# EAGLE schematic openmv2 (EAGLE 6.4)
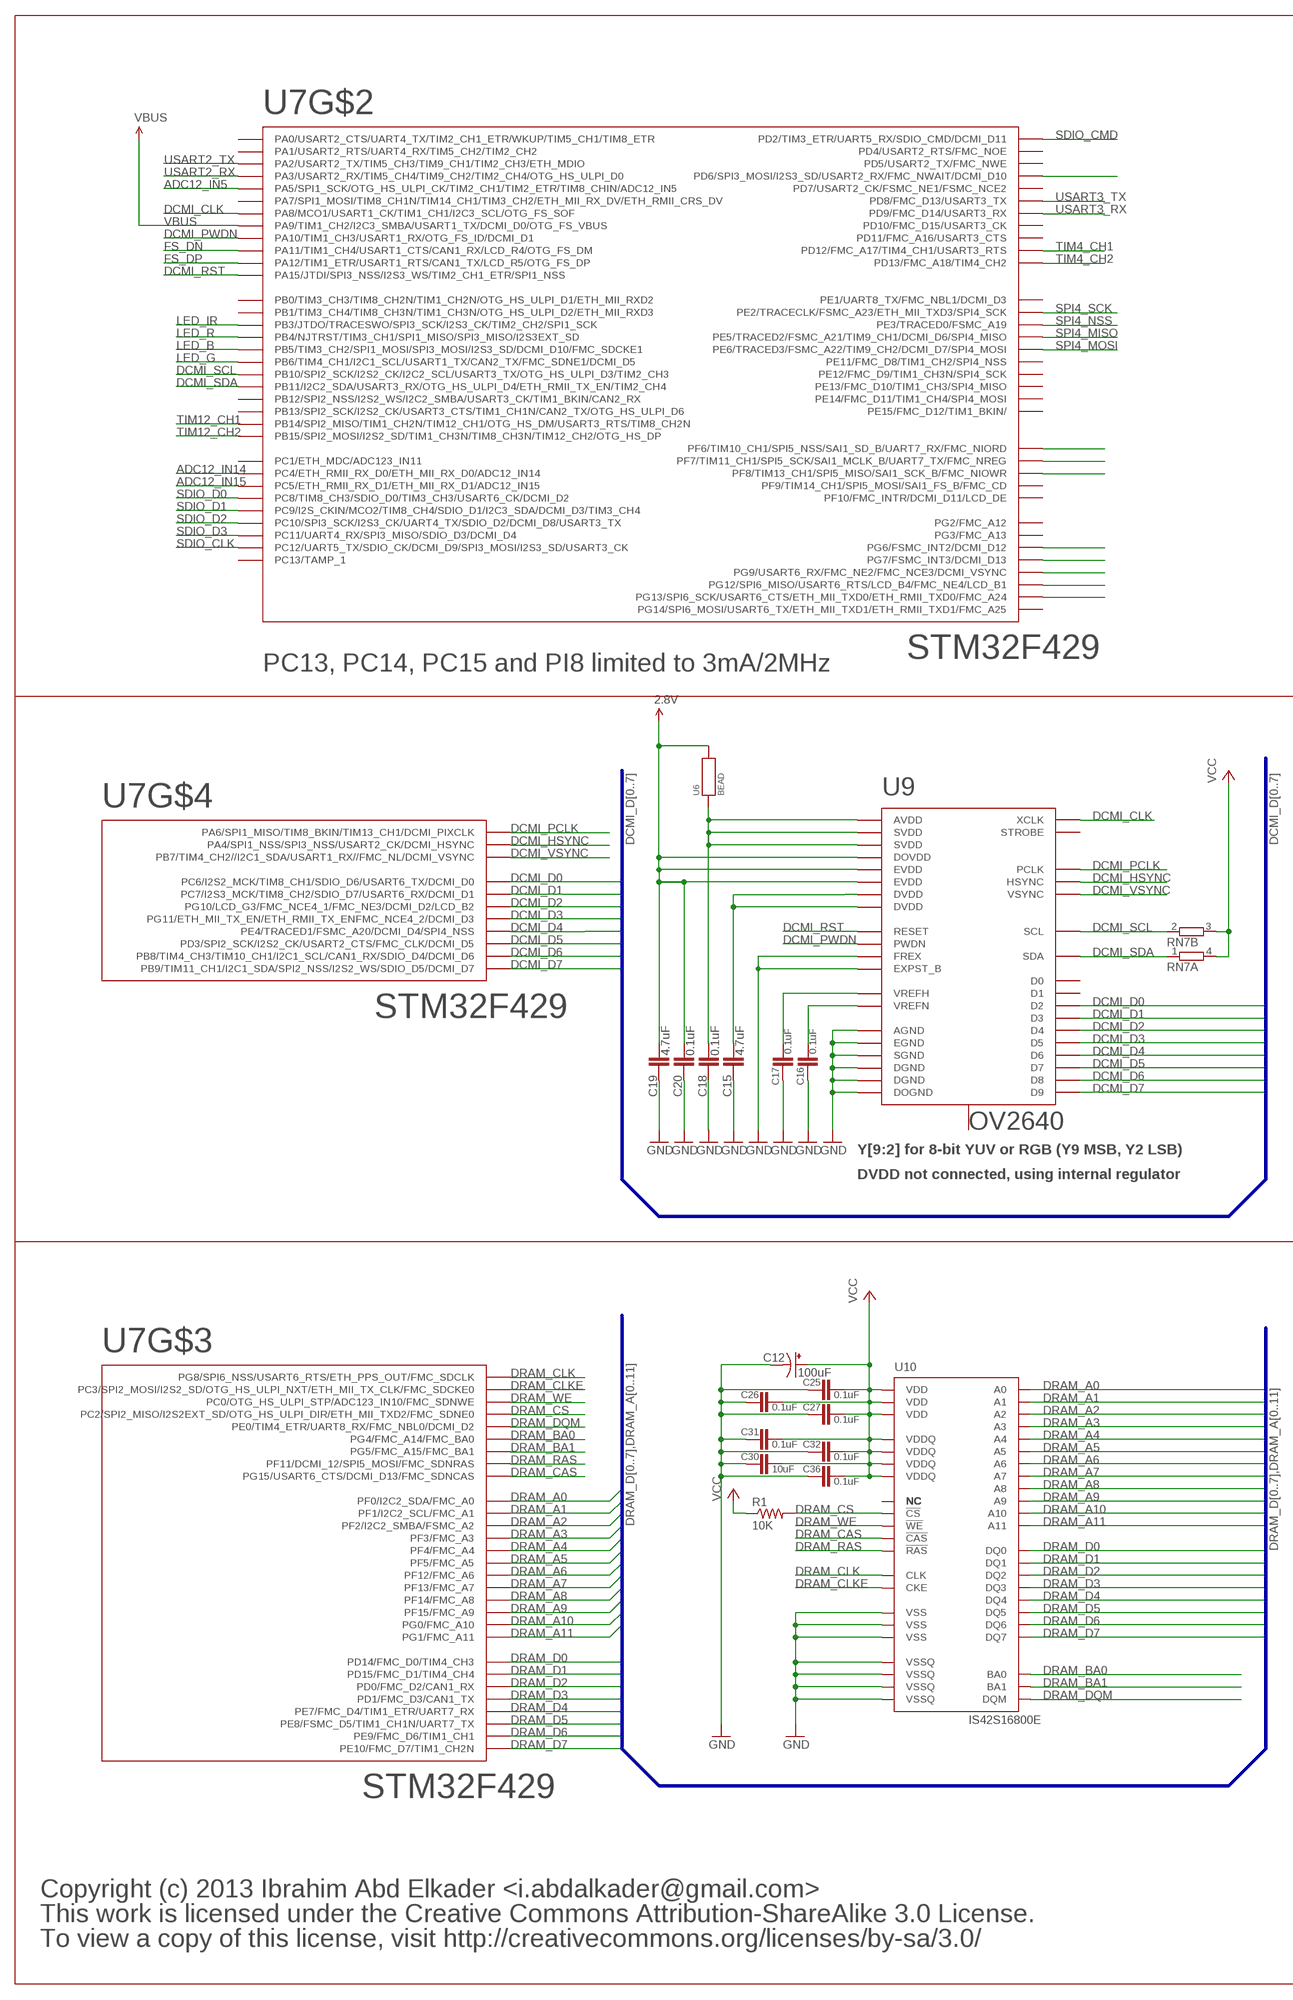
[diagram p0: schematic, sheet 1, part 1 of 2]
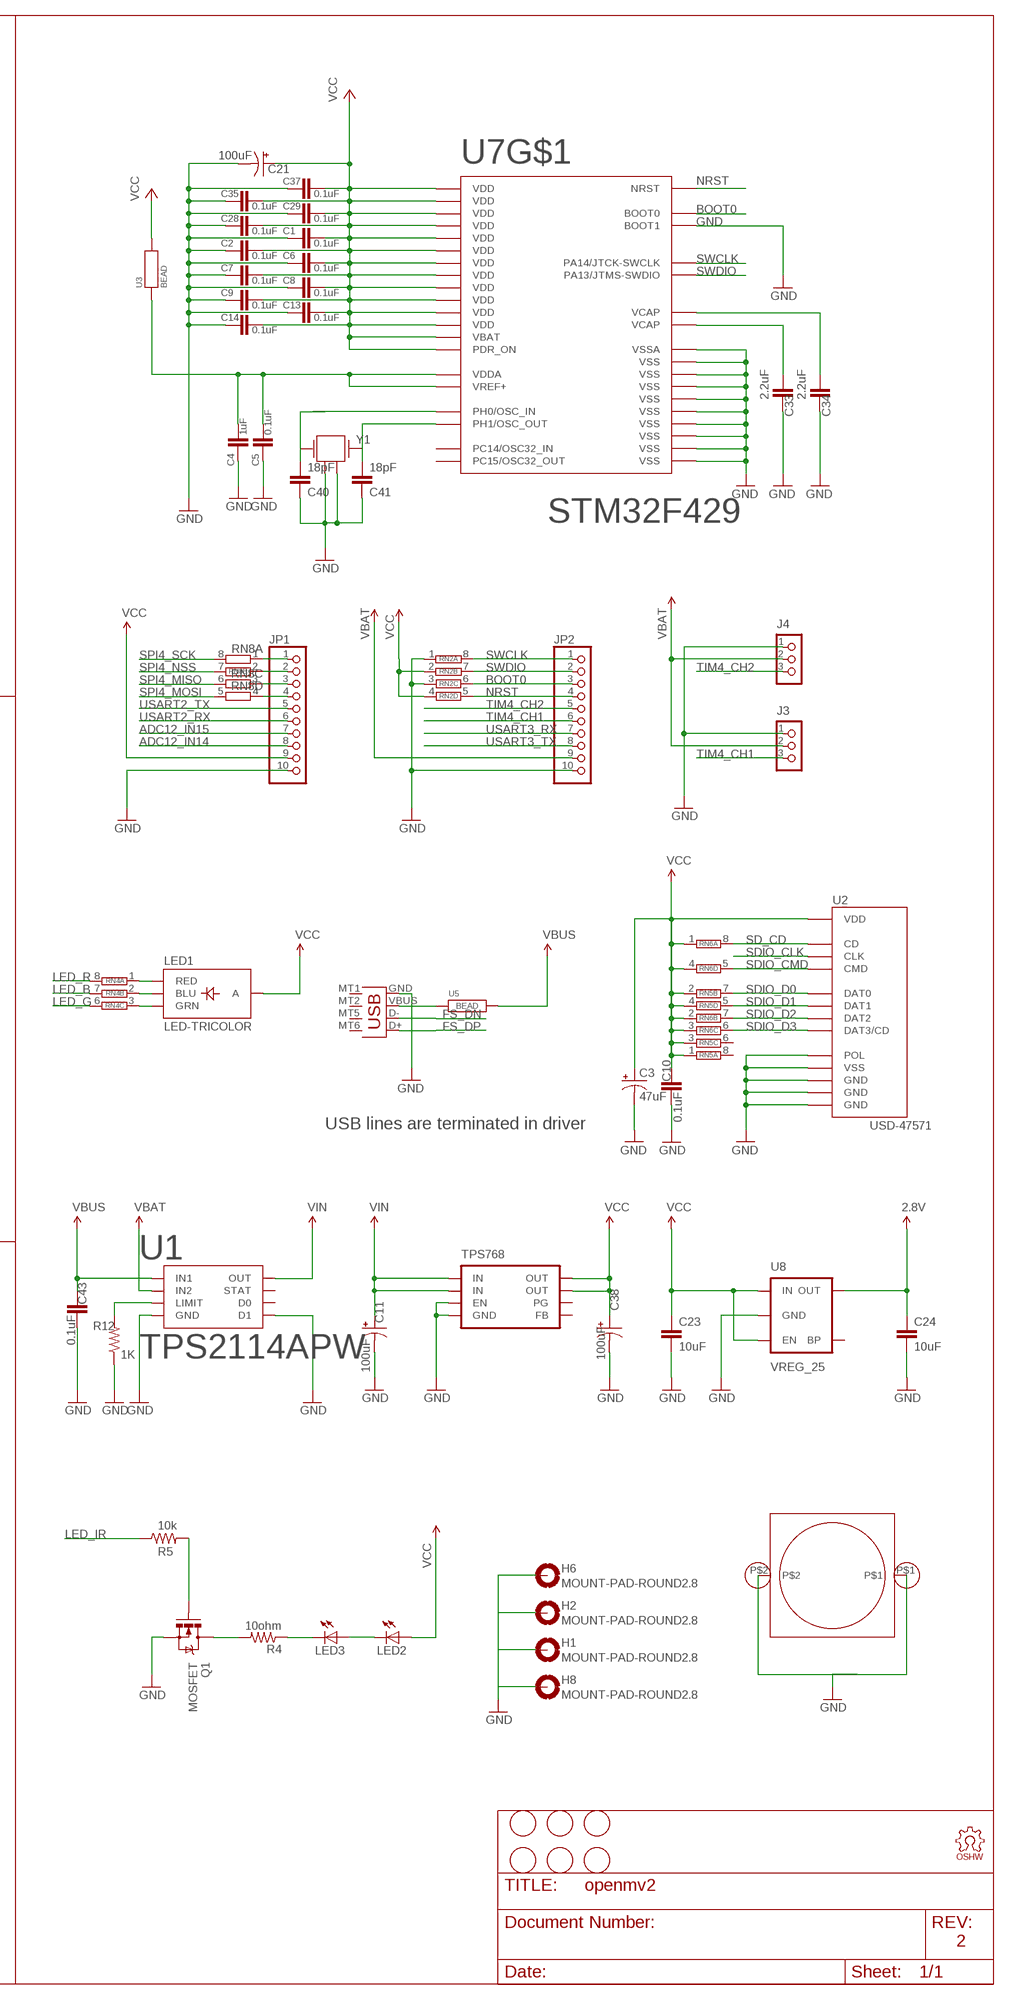
[diagram p1: schematic, sheet 1, part 2 of 2]

## Parts
C1  0.1uF  CAP0402-CAP  [0402-CAP]
C2  0.1uF  CAP0402-CAP  [0402-CAP]
C3  47uF  CAP_POL1206  [EIA3216]
C4  1uF  CAP0402-CAP  [0402-CAP]
C5  0.1uF  CAP0402-CAP  [0402-CAP]
C6  0.1uF  CAP0402-CAP  [0402-CAP]
C7  0.1uF  CAP0402-CAP  [0402-CAP]
C8  0.1uF  CAP0402-CAP  [0402-CAP]
C9  0.1uF  CAP0402-CAP  [0402-CAP]
C10  0.1uF  CAP0402-CAP  [0402-CAP]
C11  100uF  CAP_POL3528  [EIA3528]
C12  100uF  CAP_POL1206  [EIA3216]
C13  0.1uF  CAP0402-CAP  [0402-CAP]
C14  0.1uF  CAP0402-CAP  [0402-CAP]
C15  4.7uF  CAP0402-CAP  [0402-CAP]
C16  0.1uF  CAP0402-CAP  [0402-CAP]
C17  0.1uF  CAP0402-CAP  [0402-CAP]
C18  0.1uF  CAP0402-CAP  [0402-CAP]
C19  4.7uF  CAP0402-CAP  [0402-CAP]
C20  0.1uF  CAP0402-CAP  [0402-CAP]
C21  100uF  CAP_POL1206  [EIA3216]
C23  10uF  CAP0402-CAP  [0402-CAP]
C24  10uF  CAP0402-CAP  [0402-CAP]
C25  0.1uF  CAP0402-CAP  [0402-CAP]
C26  0.1uF  CAP0402-CAP  [0402-CAP]
C27  0.1uF  CAP0402-CAP  [0402-CAP]
C28  0.1uF  CAP0402-CAP  [0402-CAP]
C29  0.1uF  CAP0402-CAP  [0402-CAP]
C30  10uF  CAP0805  [0805]
C31  0.1uF  CAP0402-CAP  [0402-CAP]
C32  0.1uF  CAP0402-CAP  [0402-CAP]
C33  2.2uF  CAP0402-CAP  [0402-CAP]
C34  2.2uF  CAP0402-CAP  [0402-CAP]
C35  0.1uF  CAP0402-CAP  [0402-CAP]
C36  0.1uF  CAP0402-CAP  [0402-CAP]
C37  0.1uF  CAP0402-CAP  [0402-CAP]
C38  100uF  CAP_POL3528  [EIA3528]
C40  18pF  CAP0402-CAP  [0402-CAP]
C41  18pF  CAP0402-CAP  [0402-CAP]
C43  0.1uF  CAP0402-CAP  [0402-CAP]
H1  MOUNT-PAD-ROUND2.8  [2,8-PAD]
H2  MOUNT-PAD-ROUND2.8  [2,8-PAD]
H6  MOUNT-PAD-ROUND2.8  [2,8-PAD]
H8  MOUNT-PAD-ROUND2.8  [2,8-PAD]
J3  CON_HEADER_1X03  [M1X3_SMD]
J4  CON_HEADER_1X03  [M1X3_SMD]
JP1  PINHD-1X10  [1X10]
JP2  PINHD-1X10  [1X10]
LED1  LED-TRICOLOR  [LED-TRICOLOR-SMD]
LED2  LED3MM  [LED3MM]
LED3  LED3MM  [LED3MM]
LOGO1  OSHW_LOGO_FILLX0200-NT  [OSHW_FILLX200_NOTEXT]
Q1  MOSFET  MOSFET-NCHANNELSMD  [SOT23-3]
R1  10K  RESISTOR0402-RES  [0402-RES]
R4  10ohm  RESISTOR0402-RES  [0402-RES]
R5  10k  RESISTOR0402-RES  [0402-RES]
R12  1K  RESISTOR0402-RES  [0402-RES]
RN2  4R-NCAT16  [CAT16]
RN4  4R-NCAT16  [CAT16]
RN5  4R-NCAT16  [CAT16]
RN6  4R-NCAT16  [CAT16]
RN7  2R-NEXBV4V  [EXBV4V]
RN8  4R-NCAT16  [CAT16]
U1  TPS2114APW  TPS2115APW  [TSSOP8]
U2  USD-47571  [USD-47571]
U3  BEAD  [0402-CAP]
U4  TPS768  [SOIC8]
U5  BEAD  [0402-CAP]
U6  BEAD  [0402-CAP]
U7  STM32F429  [LQFP144]
U8  VREG_25  V_REG_LDOSMD  [SOT23-5]
U9  OV2640  [CSP2]
U10  IS42S16800E  [TSOPII-54]
U$1  LENSMOUNT  [LENSMOUNT]
U$14  FIDUCIAL  [FIDUCIAL_1MM]
U$15  FIDUCIAL  [FIDUCIAL_1MM]
U$16  FIDUCIAL  [FIDUCIAL_1MM]
U$17  FIDUCIAL  [FIDUCIAL_1MM]
U$19  FIDUCIAL  [FIDUCIAL_1MM]
U$20  FIDUCIAL  [FIDUCIAL_1MM]
X1  USB-MICROB  [USB-MICROB]
Y1  CRYSTAL  [CRYSTAL3.2X2.5]

## Nets
2.8V: C19.1 C20.1 C24.1 U6.2 U8.5(OUT) U9.B1(DOVDD) U9.F1(EVDD) U9.G1(EVDD)
ADC12_IN5: U7.41(PA5/SPI1_SCK/OTG_HS_ULPI_CK/TIM2_CH1/TIM2_ETR/TIM8_CHIN/ADC12_IN5)
ADC12_IN14: JP1.8 U7.44(PC4/ETH_RMII_RX_D0/ETH_MII_RX_D0/ADC12_IN14)
ADC12_IN15: JP1.7 U7.45(PC5/ETH_RMII_RX_D1/ETH_MII_RX_D1/ADC12_IN15)
BOOT0: JP2.3 RN2.6 U7.138(BOOT0)
DCMI_CLK: U7.100(PA8/MCO1/USART1_CK/TIM1_CH1/I2C3_SCL/OTG_FS_SOF) U9.C4(XCLK)
DCMI_D0: U7.96(PC6/I2S2_MCK/TIM8_CH1/SDIO_D6/USART6_TX/DCMI_D0) U9.F3(D2)
DCMI_D1: U7.97(PC7/I2S3_MCK/TIM8_CH2/SDIO_D7/USART6_RX/DCMI_D1) U9.G3(D3)
DCMI_D2: U7.125(PG10/LCD_G3/FMC_NCE4_1/FMC_NE3/DCMI_D2/LCD_B2) U9.F4(D4)
DCMI_D3: U7.126(PG11/ETH_MII_TX_EN/ETH_RMII_TX_ENFMC_NCE4_2/DCMI_D3) U9.G4(D5)
DCMI_D4: U7.3(PE4/TRACED1/FSMC_A20/DCMI_D4/SPI4_NSS) U9.E5(D6)
DCMI_D5: U7.117(PD3/SPI2_SCK/I2S2_CK/USART2_CTS/FMC_CLK/DCMI_D5) U9.G5(D7)
DCMI_D6: U7.139(PB8/TIM4_CH3/TIM10_CH1/I2C1_SCL/CAN1_RX/SDIO_D4/DCMI_D6) U9.F5(D8)
DCMI_D7: U7.140(PB9/TIM11_CH1/I2C1_SDA/SPI2_NSS/I2S2_WS/SDIO_D5/DCMI_D7) U9.G6(D9)
DCMI_HSYNC: U7.40(PA4/SPI1_NSS/SPI3_NSS/USART2_CK/DCMI_HSYNC) U9.C3(HSYNC)
DCMI_PCLK: U7.42(PA6/SPI1_MISO/TIM8_BKIN/TIM13_CH1/DCMI_PIXCLK) U9.E3(PCLK)
DCMI_PWDN: U7.102(PA10/TIM1_CH3/USART1_RX/OTG_FS_ID/DCMI_D1) U9.B6(PWDN)
DCMI_RST: U7.110(PA15/JTDI/SPI3_NSS/I2S3_WS/TIM2_CH1_ETR/SPI1_NSS) U9.C6(RESET)
DCMI_SCL: RN7.2 U7.69(PB10/SPI2_SCK/I2S2_CK/I2C2_SCL/USART3_TX/OTG_HS_ULPI_D3/TIM2_CH3) U9.C2(SCL)
DCMI_SDA: RN7.1 U7.70(PB11/I2C2_SDA/USART3_RX/OTG_HS_ULPI_D4/ETH_RMII_TX_EN/TIM2_CH4) U9.C1(SDA)
DCMI_VSYNC: U7.137(PB7/TIM4_CH2//I2C1_SDA/USART1_RX//FMC_NL/DCMI_VSYNC) U9.D2(VSYNC)
DRAM_A0: U7.10(PF0/I2C2_SDA/FMC_A0) U10.23(A0)
DRAM_A1: U7.11(PF1/I2C2_SCL/FMC_A1) U10.24(A1)
DRAM_A2: U7.12(PF2/I2C2_SMBA/FSMC_A2) U10.25(A2)
DRAM_A3: U7.13(PF3/FMC_A3) U10.26(A3)
DRAM_A4: U7.14(PF4/FMC_A4) U10.29(A4)
DRAM_A5: U7.15(PF5/FMC_A5) U10.30(A5)
DRAM_A6: U7.50(PF12/FMC_A6) U10.31(A6)
DRAM_A7: U7.53(PF13/FMC_A7) U10.32(A7)
DRAM_A8: U7.54(PF14/FMC_A8) U10.33(A8)
DRAM_A9: U7.55(PF15/FMC_A9) U10.34(A9)
DRAM_A10: U7.56(PG0/FMC_A10) U10.22(A10)
DRAM_A11: U7.57(PG1/FMC_A11) U10.35(A11)
DRAM_BA0: U7.89(PG4/FMC_A14/FMC_BA0) U10.20(BA0)
DRAM_BA1: U7.90(PG5/FMC_A15/FMC_BA1) U10.21(BA1)
DRAM_CAS: U7.132(PG15/USART6_CTS/DCMI_D13/FMC_SDNCAS) U10.17(!CAS)
DRAM_CLK: U7.93(PG8/SPI6_NSS/USART6_RTS/ETH_PPS_OUT/FMC_SDCLK) U10.38(CLK)
DRAM_CLKE: U7.29(PC3/SPI2_MOSI/I2S2_SD/OTG_HS_ULPI_NXT/ETH_MII_TX_CLK/FMC_SDCKE0) U10.37(CKE)
DRAM_CS: R1.2 U7.28(PC2/SPI2_MISO/I2S2EXT_SD/OTG_HS_ULPI_DIR/ETH_MII_TXD2/FMC_SDNE0) U10.19(!CS)
DRAM_D0: U7.85(PD14/FMC_D0/TIM4_CH3) U10.2(DQ0)
DRAM_D1: U7.86(PD15/FMC_D1/TIM4_CH4) U10.5(DQ1)
DRAM_D2: U7.114(PD0/FMC_D2/CAN1_RX) U10.8(DQ2)
DRAM_D3: U7.115(PD1/FMC_D3/CAN1_TX) U10.11(DQ3)
DRAM_D4: U7.58(PE7/FMC_D4/TIM1_ETR/UART7_RX) U10.44(DQ4)
DRAM_D5: U7.59(PE8/FSMC_D5/TIM1_CH1N/UART7_TX) U10.47(DQ5)
DRAM_D6: U7.60(PE9/FMC_D6/TIM1_CH1) U10.50(DQ6)
DRAM_D7: U7.63(PE10/FMC_D7/TIM1_CH2N) U10.53(DQ7)
DRAM_DQM: U7.141(PE0/TIM4_ETR/UART8_RX/FMC_NBL0/DCMI_D2) U10.39(DQM)
DRAM_RAS: U7.49(PF11/DCMI_12/SPI5_MOSI/FMC_SDNRAS) U10.18(!RAS)
DRAM_WE: U7.26(PC0/OTG_HS_ULPI_STP/ADC123_IN10/FMC_SDNWE) U10.16(!WE)
FS_DN: U7.103(PA11/TIM1_CH4/USART1_CTS/CAN1_RX/LCD_R4/OTG_FS_DM) X1.D-
FS_DP: U7.104(PA12/TIM1_ETR/USART1_RTS/CAN1_TX/LCD_R5/OTG_FS_DP) X1.D+
GND: C1.2 C2.2 C3.C(-) C4.2 C5.2 C6.2 C7.2 C8.2 C9.2 C10.2 C11.C(-) C12.C(-) C13.2 C14.2 C15.2 C16.2 C17.2 C18.2 C19.2 C20.2 C21.C(-) C23.2 C24.2 C25.2 C26.2 C27.2 C28.1 C29.2 C30.2 C31.2 C32.2 C33.2 C34.2 C35.2 C36.2 C37.2 C38.C(-) C40.1 C41.1 C43.2 H1.B2,8(MOUNT) H2.B2,8(MOUNT) H6.B2,8(MOUNT) H8.B2,8(MOUNT) J3.1 J4.1 JP1.10 JP2.10 Q1.2(S) R12.1 RN2.1 RN2.3 U1.3(D1) U1.5(GND) U2.G$1(GND) U2.G$2(GND) U2.G$3(GND) U2.G$4(POL) U2.P$6(VSS) U4.1(GND) U4.2(EN) U7.16(VSS) U7.31(VSSA) U7.38(VSS) U7.48(BOOT1) U7.51(VSS) U7.61(VSS) U7.83(VSS) U7.94(VSS) U7.107(VSS) U7.120(VSS) U7.130(VSS) U8.2(GND) U9.A1(DOGND) U9.A2(EXPST_B) U9.A3(AGND) U9.A4(SGND) U9.B2(FREX) U9.E4(EGND) U9.E6(DGND) U9.G2(DGND) U10.6(VSSQ) U10.12(VSSQ) U10.28(VSS) U10.41(VSS) U10.46(VSSQ) U10.52(VSSQ) U10.54(VSS) U$1.P$1 U$1.P$2 X1.GND Y1.2 Y1.4
LED_B: RN4.7 U7.135(PB5/TIM3_CH2/SPI1_MOSI/SPI3_MOSI/I2S3_SD/DCMI_D10/FMC_SDCKE1)
LED_G: RN4.6 U7.136(PB6/TIM4_CH1/I2C1_SCL/USART1_TX/CAN2_TX/FMC_SDNE1/DCMI_D5)
LED_IR: R5.1 U7.133(PB3/JTDO/TRACESWO/SPI3_SCK/I2S3_CK/TIM2_CH2/SPI1_SCK)
LED_R: RN4.8 U7.134(PB4/NJTRST/TIM3_CH1/SPI1_MISO/SPI3_MISO/I2S3EXT_SD)
N$1: C17.1 U9.C5(VREFH)
N$2: C40.2 U7.23(PH0/OSC_IN) Y1.3
N$3: C16.1 U9.A5(VREFN)
N$4: C41.2 U7.24(PH1/OSC_OUT) Y1.1
N$5: Q1.1(G) R5.2
N$6: C15.1 U9.F2(DVDD) U9.F6(DVDD)
N$7: C4.1 C5.1 U3.1 U7.32(VREF+) U7.33(VDDA)
N$8: LED1.R(RED) RN4.1
N$9: LED1.G(GRN) RN4.3
N$10: LED3.K(C) R4.1
N$11: LED1.B(BLU) RN4.2
N$12: U7.127(PG12/SPI6_MISO/USART6_RTS/LCD_B4/FMC_NE4/LCD_B1)
N$13: C18.1 U6.1 U9.B3(AVDD) U9.B4(SVDD) U9.B5(SVDD)
N$14: Q1.3(D) R4.2
N$15: U7.128(PG13/SPI6_SCK/USART6_CTS/ETH_MII_TXD0/ETH_RMII_TXD0/FMC_A24)
N$16: LED2.K(C) LED3.A
N$17: U7.92(PG7/FSMC_INT3/DCMI_D13)
N$18: U7.18(PF6/TIM10_CH1/SPI5_NSS/SAI1_SD_B/UART7_RX/FMC_NIORD)
N$19: U7.91(PG6/FSMC_INT2/DCMI_D12)
N$20: JP1.1 RN8.1
N$21: JP1.2 RN8.2
N$22: U5.1 X1.VBUS
N$23: JP1.3 RN8.3
N$24: JP1.4 RN8.4
N$25: U7.122(PD6/SPI3_MOSI/I2S3_SD/USART2_RX/FMC_NWAIT/DCMI_D10)
N$26: R12.2 U1.4(LIMIT)
N$27: U7.19(PF7/TIM11_CH1/SPI5_SCK/SAI1_MCLK_B/UART7_TX/FMC_NREG)
N$28: U7.20(PF8/TIM13_CH1/SPI5_MISO/SAI1_SCK_B/FMC_NIOWR)
NRST: JP2.4 RN2.5 U7.25(NRST)
SD_CD: RN6.8 U2.G$5(CD) U7.124(PG9/USART6_RX/FMC_NE2/FMC_NCE3/DCMI_VSYNC)
SDIO_CLK: U2.P$5(CLK) U7.113(PC12/UART5_TX/SDIO_CK/DCMI_D9/SPI3_MOSI/I2S3_SD/USART3_CK)
SDIO_CMD: RN6.5 U2.P$3(CMD) U7.116(PD2/TIM3_ETR/UART5_RX/SDIO_CMD/DCMI_D11)
SDIO_D0: RN5.7 U2.P$7(DAT0) U7.98(PC8/TIM8_CH3/SDIO_D0/TIM3_CH3/USART6_CK/DCMI_D2)
SDIO_D1: RN5.5 U2.P$8(DAT1) U7.99(PC9/I2S_CKIN/MCO2/TIM8_CH4/SDIO_D1/I2C3_SDA/DCMI_D3/TIM3_CH4)
SDIO_D2: RN6.7 U2.P$1(DAT2) U7.111(PC10/SPI3_SCK/I2S3_CK/UART4_TX/SDIO_D2/DCMI_D8/USART3_TX)
SDIO_D3: RN6.6 U2.P$2(DAT3/CD) U7.112(PC11/UART4_RX/SPI3_MISO/SDIO_D3/DCMI_D4)
SPI4_MISO: RN8.6 U7.4(PE5/TRACED2/FSMC_A21/TIM9_CH1/DCMI_D6/SPI4_MISO)
SPI4_MOSI: RN8.5 U7.5(PE6/TRACED3/FSMC_A22/TIM9_CH2/DCMI_D7/SPI4_MOSI)
SPI4_NSS: RN8.7 U7.2(PE3/TRACED0/FSMC_A19)
SPI4_SCK: RN8.8 U7.1(PE2/TRACECLK/FSMC_A23/ETH_MII_TXD3/SPI4_SCK)
SWCLK: JP2.1 RN2.8 U7.109(PA14/JTCK-SWCLK)
SWDIO: JP2.2 RN2.7 U7.105(PA13/JTMS-SWDIO)
TIM4_CH1: J3.3 JP2.6 U7.81(PD12/FMC_A17/TIM4_CH1/USART3_RTS)
TIM4_CH2: J4.3 JP2.5 U7.82(PD13/FMC_A18/TIM4_CH2)
TIM12_CH1: U7.75(PB14/SPI2_MISO/TIM1_CH2N/TIM12_CH1/OTG_HS_DM/USART3_RTS/TIM8_CH2N)
TIM12_CH2: U7.76(PB15/SPI2_MOSI/I2S2_SD/TIM1_CH3N/TIM8_CH3N/TIM12_CH2/OTG_HS_DP)
USART2_RX: JP1.6 U7.37(PA3/USART2_RX/TIM5_CH4/TIM9_CH2/TIM2_CH4/OTG_HS_ULPI_D0)
USART2_TX: JP1.5 U7.36(PA2/USART2_TX/TIM5_CH3/TIM9_CH1/TIM2_CH3/ETH_MDIO)
USART3_RX: JP2.7 U7.78(PD9/FMC_D14/USART3_RX)
USART3_TX: JP2.8 U7.77(PD8/FMC_D13/USART3_TX)
VBAT: J3.2 J4.2 JP2.9 U1.6(IN2)
VBUS: C43.1 U1.8(IN1) U5.2 U7.101(PA9/TIM1_CH2/I2C3_SMBA/USART1_TX/DCMI_D0/OTG_FS_VBUS)
VCAP1: C34.1 U7.71(VCAP)
VCAP2: C33.1 U7.106(VCAP)
VCC: C1.1 C2.1 C3.A(+) C6.1 C7.1 C8.1 C9.1 C10.1 C12.A(+) C13.1 C14.1 C21.A(+) C23.1 C25.1 C26.1 C27.1 C28.2 C29.1 C30.1 C31.1 C32.1 C35.1 C36.1 C37.1 C38.A(+) JP1.9 LED1.A LED2.A R1.1 RN2.2 RN2.4 RN5.1 RN5.2 RN5.3 RN5.4 RN6.1 RN6.2 RN6.3 RN6.4 RN7.3 RN7.4 U2.P$4(VDD) U3.2 U4.5(OUT) U4.6(OUT) U7.6(VBAT) U7.17(VDD) U7.30(VDD) U7.39(VDD) U7.52(VDD) U7.62(VDD) U7.72(VDD) U7.84(VDD) U7.95(VDD) U7.108(VDD) U7.121(VDD) U7.131(VDD) U7.143(PDR_ON) U7.144(VDD) U8.1(IN) U8.3(EN) U10.1(VDD) U10.3(VDDQ) U10.9(VDDQ) U10.14(VDD) U10.27(VDD) U10.43(VDDQ) U10.49(VDDQ)
VIN: C11.A(+) U1.7(OUT) U4.3(IN) U4.4(IN)
Unconnected: RN4.4 RN4.5 RN5.6 RN5.8 U1.1(STAT) U1.2(D0) U4.7(FB) U4.8(PG) U7.7(PC13/TAMP_1) U7.8(PC14/OSC32_IN) U7.9(PC15/OSC32_OUT) U7.21(PF9/TIM14_CH1/SPI5_MOSI/SAI1_FS_B/FMC_CD) U7.22(PF10/FMC_INTR/DCMI_D11/LCD_DE) U7.27(PC1/ETH_MDC/ADC123_IN11) U7.34(PA0/USART2_CTS/UART4_TX/TIM2_CH1_ETR/WKUP/TIM5_CH1/TIM8_ETR) U7.35(PA1/USART2_RTS/UART4_RX/TIM5_CH2/TIM2_CH2) U7.43(PA7/SPI1_MOSI/TIM8_CH1N/TIM14_CH1/TIM3_CH2/ETH_MII_RX_DV/ETH_RMII_CRS_DV) U7.46(PB0/TIM3_CH3/TIM8_CH2N/TIM1_CH2N/OTG_HS_ULPI_D1/ETH_MII_RXD2) U7.47(PB1/TIM3_CH4/TIM8_CH3N/TIM1_CH3N/OTG_HS_ULPI_D2/ETH_MII_RXD3) U7.64(PE11/FMC_D8/TIM1_CH2/SPI4_NSS) U7.65(PE12/FMC_D9/TIM1_CH3N/SPI4_SCK) U7.66(PE13/FMC_D10/TIM1_CH3/SPI4_MISO) U7.67(PE14/FMC_D11/TIM1_CH4/SPI4_MOSI) U7.68(PE15/FMC_D12/TIM1_BKIN/) U7.73(PB12/SPI2_NSS/I2S2_WS/I2C2_SMBA/USART3_CK/TIM1_BKIN/CAN2_RX) U7.74(PB13/SPI2_SCK/I2S2_CK/USART3_CTS/TIM1_CH1N/CAN2_TX/OTG_HS_ULPI_D6) U7.79(PD10/FMC_D15/USART3_CK) U7.80(PD11/FMC_A16/USART3_CTS) U7.87(PG2/FMC_A12) U7.88(PG3/FMC_A13) U7.118(PD4/USART2_RTS/FMC_NOE) U7.119(PD5/USART2_TX/FMC_NWE) U7.123(PD7/USART2_CK/FSMC_NE1/FSMC_NCE2) U7.129(PG14/SPI6_MOSI/USART6_TX/ETH_MII_TXD1/ETH_RMII_TXD1/FMC_A25) U7.142(PE1/UART8_TX/FMC_NBL1/DCMI_D3) U8.4(BP) U9.A6(STROBE) U9.D6(NC) U9.E1(D1) U9.E2(D0) U10.4(NC) U10.7(NC) U10.10(NC) U10.13(NC) U10.15(NC) U10.36(NC) U10.40(NC) U10.42(NC) U10.45(NC) U10.48(NC) U10.51(NC) X1.MT1(GND1) X1.MT2(GND2) X1.MT5(GND3) X1.MT6(GND4)

## Buses
DCMI_D[0..7]
DRAM_D[0..7],DRAM_A[0..11]

## Notes on the sheet
- PC13, PC14, PC15 and PI8 limited to 3mA/2MHz
- USB lines are terminated in driver
- Y[9:2] for 8-bit YUV or RGB (Y9 MSB, Y2 LSB)
- DVDD not connected, using internal regulator
- Copyright (c) 2013 Ibrahim Abd Elkader <i.abdalkader@gmail.com>
- This work is licensed under the Creative Commons Attribution-ShareAlike 3.0 License.
- To view a copy of this license, visit http://creativecommons.org/licenses/by-sa/3.0/ | 2

## Library data of the parts
C1 C2 C4-C10 C13-C20 C23-C37 C40 C41 C43 = sfe:CAP: Capacitor Standard 0603 ceramic capacitor, and 0.1" leaded capacitor.
C3 C11 C12 C21 C38 = sfe:CAP_POL: Capacitor Polarized These are standard SMD and PTH capacitors. Normally 10uF, 47uF, and 100uF in electrolytic and tantalum varieties. Always verify the external diameter of the through hole cap, it varies with capacity, voltage, and manufacturer. The EIA devices should be standard.
H1 H2 H6 H8 = holes:MOUNT-PAD-ROUND: MOUNTING PAD, round
J3 J4 = dp_devices:CON_HEADER_1X03
JP1 JP2 = pinhead:PINHD-1X10: PIN HEADER
LED1 = sfe:LED-TRICOLOR: Tri-Color LED SMD Proven layout and schematic for triple color LED in SMD package - common anode. Spark Fun Electronics SKU : COM-07844
LED2 LED3 = sfe:LED: LEDs Standard schematic elements and footprints for 5mm, 3mm, 1206, and 0603 sized LEDs. 5mm - Spark Fun Electronics SKU : COM-00529 (and others)
LOGO1 = iofault:OSHW_LOGO_FILL
Q1 = sfe:MOSFET-NCHANNEL
R1 R5 R12 = sfe:RESISTOR: Resistor Basic schematic elements and footprints for 0603, 1206, and PTH resistors.
R4 = iofault:RESISTOR: Resistor Basic schematic elements and footprints for 0603, 1206, and PTH resistors.
RN2 RN4-RN6 RN8 = resistor-dil:4R-N: Array Chip Resistor Source: RS Component / Phycomp; OC_FARNELL: unknown; OC_NEWARK: unknown
RN7 = resistor-dil:2R-N: Array Chip Resistor Source: Panasonic; OC_FARNELL: unknown; OC_NEWARK: unknown
U1 = mux:TPS2115APW
U2 = mux:USD-47571
U3 U5 U6 = heka:BEAD
U4 = mux:TPS768
U7 = stm32:STM32F429
U8 = sfe:V_REG_LDO: Voltage Regulator LDO Standard 150mA LDO voltage regulator in SOT-23 layout. Micrel part MIC5205. BP (by-pass) pin is used to lower output noise with 470pF cap.
U9 = omnivision:OV2640
U10 = mux:IS42S16800E
U$1 = omnivision:LENSMOUNT
U$14-U$17 U$19 U$20 = adafruit:FIDUCIAL: For use by pick and place machines to calibrate the vision/machine, 1mm By microbuilder.eu
X1 = sfe:USB: USB Connectors USB-B-PTH is fully proven SKU : PRT-00139 USB-miniB is fully proven SKU : PRT-00587 USB-A-PCB is untested. USB-A-H is throughly reviewed, but untested. Spark Fun Electronics SKU : PRT-00437 USB-B-SMT is throughly reviewed, but untested. Needs silkscreen touching up. USB-A-S has not been used/tested USB-MB-H has not been used/tested
Y1 = mux:CRYSTAL: Crystals Various standard crystals. Proven footprints. Spark Fun Electronics SKU : COM-00534